# Altium schematic sheet DigitalInterfaces.SchDoc: DigitalInterfaces
size A4; Author: Joao Guimaraes; Organization: Altium Limited; Address1: L3, 12a Rodborough Rd; Address2: Frenchs Forest; Address3: NSW; Address4: Australia 2086; Revision: 1.0.0
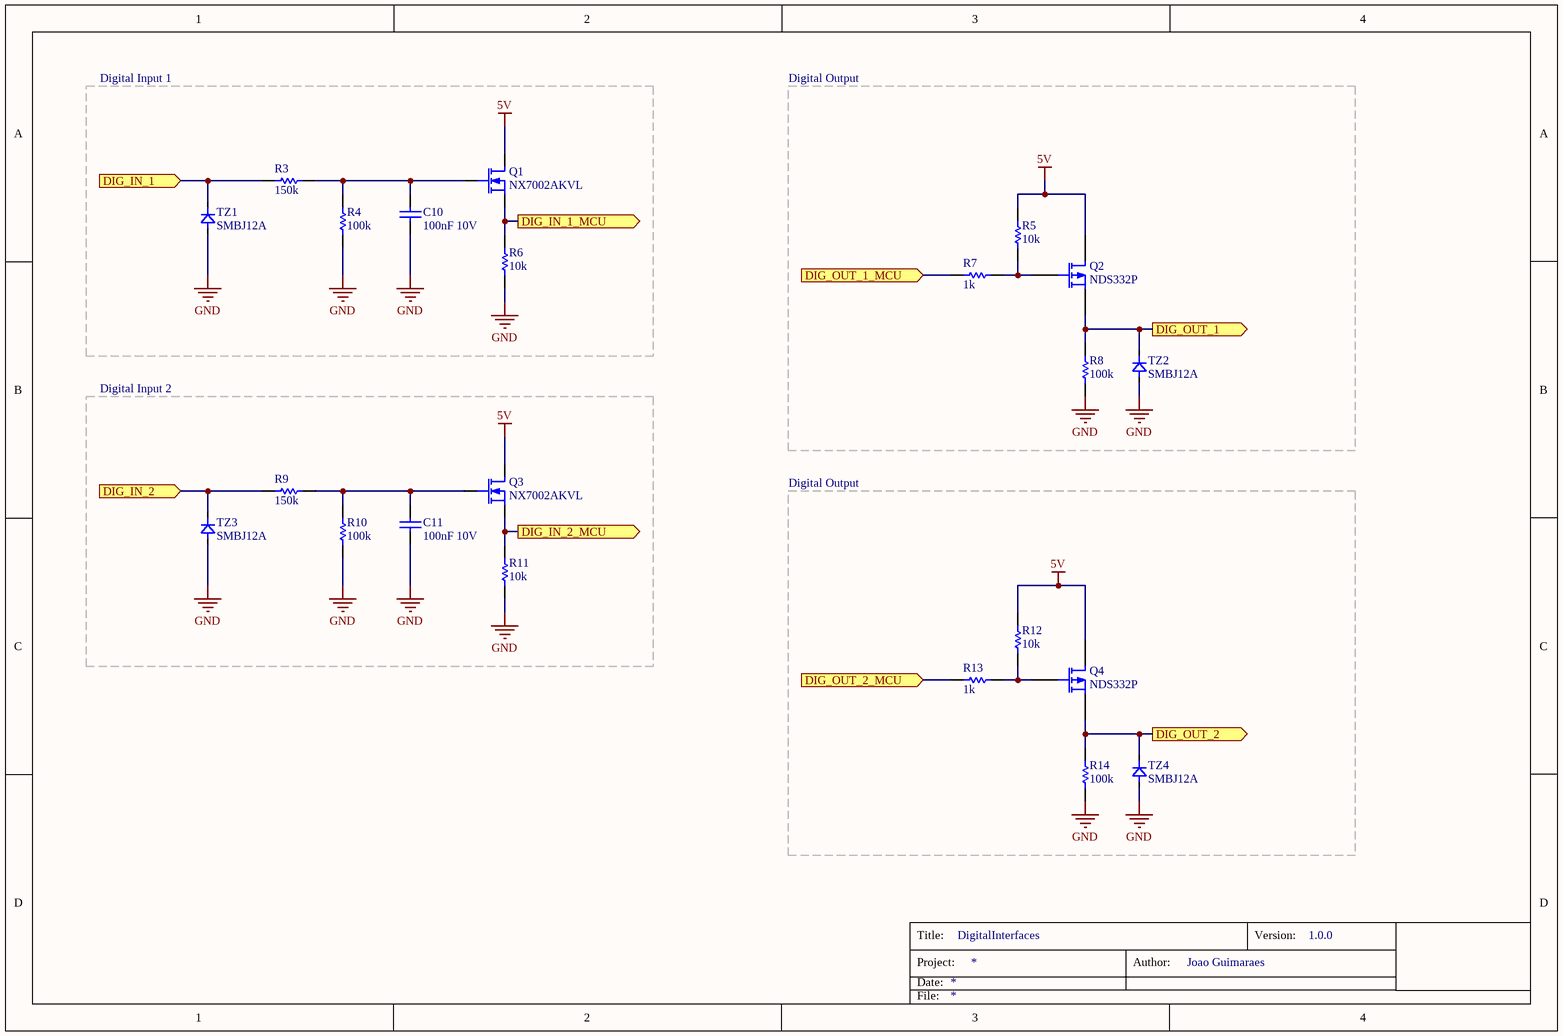
[diagram p0: DigitalInterfaces.SchDoc]

## Parts
C10  100nF 10V  [0402]
C11  100nF 10V  [0402]
Q1  NX7002AKVL  [SOT23_M]
Q2  NDS332P  [SOT23_M]
Q3  NX7002AKVL  [SOT23_M]
Q4  NDS332P  [SOT23_M]
R3  150k  [6-0805_M]
R4  100k  [6-0805_M]
R5  10k  [6-0805_M]
R6  10k  [6-0805_M]
R7  1k  [6-0805_M]
R8  100k  [6-0805_M]
R9  150k  [6-0805_M]
R10  100k  [6-0805_M]
R11  10k  [6-0805_M]
R12  10k  [6-0805_M]
R13  1k  [6-0805_M]
R14  100k  [6-0805_M]
TZ1  SMBJ12A  [DO-214AA]
TZ2  SMBJ12A  [DO-214AA]
TZ3  SMBJ12A  [DO-214AA]
TZ4  SMBJ12A  [DO-214AA]

## Blocks framed on the sheet
Digital Input 1: C10 Q1 R3 R4 R6 TZ1
Digital Output: Q2 R5 R7 R8 TZ2
Digital Input 2: C11 Q3 R9-R11 TZ3
Digital Output: Q4 R12-R14 TZ4

## Ports
DIG_IN_1 (in), DIG_IN_1_MCU (out), DIG_IN_2 (in), DIG_IN_2_MCU (out), DIG_OUT_1 (out), DIG_OUT_1_MCU (in), DIG_OUT_2 (out), DIG_OUT_2_MCU (in)

## Nets
5V: Q1.3(D) Q2.1(D) Q3.3(D) Q4.1(D) R5.2 R12.2
GND: C10.1 C11.1 R4.1 R6.1 R8.1 R10.1 R11.1 R14.1 TZ1.1(A) TZ2.1(A) TZ3.1(A) TZ4.1(A)
DIG_IN_1: R3.1 TZ1.2(C) ; port DIG_IN_1
DIG_IN_1_MCU: Q1.2(S) R6.2 ; port DIG_IN_1_MCU
DIG_IN_2: R9.1 TZ3.2(C) ; port DIG_IN_2
DIG_IN_2_MCU: Q3.2(S) R11.2 ; port DIG_IN_2_MCU
DIG_OUT_1: Q2.2(S) R8.2 TZ2.2(C) ; port DIG_OUT_1
DIG_OUT_1_MCU: R7.1 ; port DIG_OUT_1_MCU
DIG_OUT_2: Q4.2(S) R14.2 TZ4.2(C) ; port DIG_OUT_2
DIG_OUT_2_MCU: R13.1 ; port DIG_OUT_2_MCU
NetC10_2: C10.2 Q1.1(G) R3.2 R4.2
NetC11_2: C11.2 Q3.1(G) R9.2 R10.2
NetQ2_3: Q2.3(G) R5.1 R7.2
NetQ4_3: Q4.3(G) R12.1 R13.2

## Notes on the sheet
- Title:
- Project:
- Date:
- Author:
- Version:
- File:

## Library data of the parts
C10 C11 = Cap: Capacitor; PartNumber: CAP.100n.10V.20%.SMD.0402; Manufacturer: Wurth; ClassName: DigitalInterfaces; Price: 0.015; Supplier: Mouser
Q1 Q3 = NX7002AKVL: Small Signal MOSFET 60 V, 310 mA, Single, N−Channel, SOT−23; Manufacturer: Nexperia; ClassName: DigitalInterfaces; PartNumber: NX7002AKVL; Price: 0.16; Supplier: Mouser
Q2 = NDS332P: P-Channel Logic Level Enhancement MOSFET; ClassName: DigitalInterfaces; Price: 0.40; PartNumber: NDS332P; Supplier: Mouser; Manufacturer: NDS332P
Q4 = NDS332P: P-Channel Logic Level Enhancement MOSFET; Manufacturer: ON Semiconductor; ClassName: DigitalInterfaces; Price: 0.40; PartNumber: NDS332P; Supplier: Mouser
R3 R9 = Res: Resistor; PartNumber: RES.150K.1/8W.5%.SMD.0805; Manufacturer: Vishay; ClassName: DigitalInterfaces; Price: 0.10; Supplier: Mouser
R4 R8 R10 R12 R14 = Res: Resistor; PartNumber: RES.100K.1/8W.5%.SMD.0805; Manufacturer: Vishay; ClassName: DigitalInterfaces; Price: 0.012; Supplier: Mouser
R5 R6 R11 = Res: Resistor; PartNumber: RES.10K.1/8W.5%.SMD.0805; Manufacturer: Yageo; ClassName: DigitalInterfaces; Supplier: Mouser
  R5: Price: 0.013
  R6 R11: Price: 0.012
R7 R13 = Res: Resistor; PartNumber: RES.1K.1/8W.5%.SMD.0805; Manufacturer: Yageo; ClassName: DigitalInterfaces; Price: 0.012; Supplier: Mouser
TZ1-TZ4 = SMBJ12A: ESD Suppressors / TVS Diodes 12V 600W SMB Unidirectional; pin to pad: 1>A 2>C; Manufacturer: ON Semiconductor; ClassName: DigitalInterfaces; PartNumber: SMBJ12A; Price: 0.37; Supplier: Mouser